# EAGLE design nfc-pn532-old (EAGLE 9.6.2)
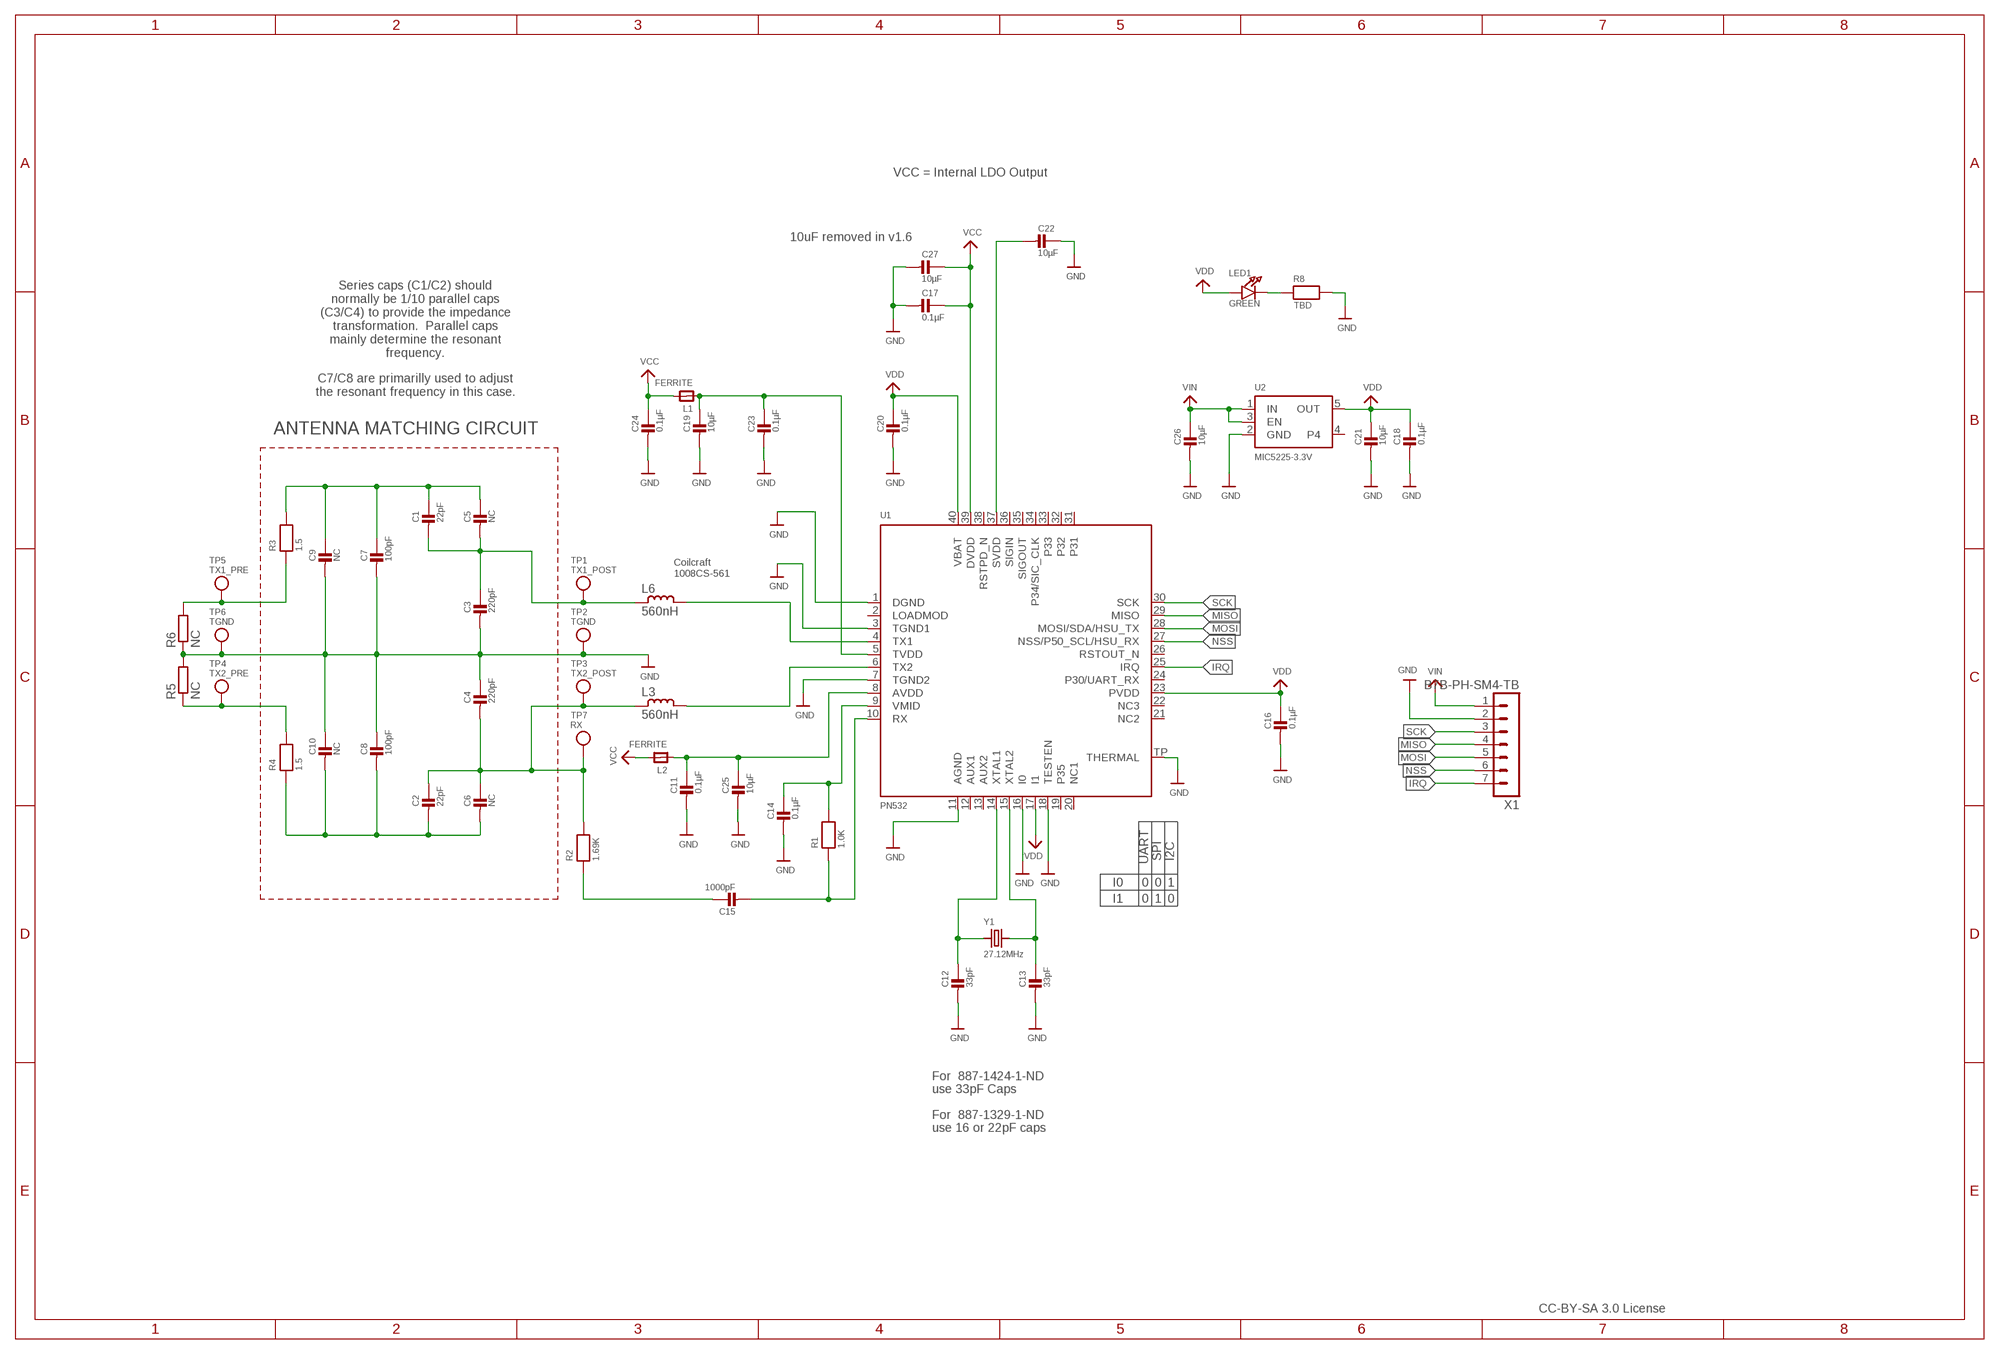
[diagram p0: schematic, sheet 1]

## Parts
C1  22pF  CAP_CERAMIC0805-NOOUTLINE  [0805-NO]
C2  22pF  CAP_CERAMIC0805-NOOUTLINE  [0805-NO]
C3  220pF  CAP_CERAMIC0805-NOOUTLINE  [0805-NO]
C4  220pF  CAP_CERAMIC0805-NOOUTLINE  [0805-NO]
C5  NC  CAP_CERAMIC0805-NOOUTLINE  [0805-NO]
C6  NC  CAP_CERAMIC0805-NOOUTLINE  [0805-NO]
C7  100pF  CAP_CERAMIC0805-NOOUTLINE  [0805-NO]
C8  100pF  CAP_CERAMIC0805-NOOUTLINE  [0805-NO]
C9  NC  CAP_CERAMIC0805-NOOUTLINE  [0805-NO]
C10  NC  CAP_CERAMIC0805-NOOUTLINE  [0805-NO]
C11  0.1µF  CAP_CERAMIC0805-NOOUTLINE  [0805-NO]
C12  33pF  CAP_CERAMIC0805-NOOUTLINE  [0805-NO]
C13  33pF  CAP_CERAMIC0805-NOOUTLINE  [0805-NO]
C14  0.1µF  CAP_CERAMIC0805-NOOUTLINE  [0805-NO]
C15  1000pF  CAP_CERAMIC0805-NOOUTLINE  [0805-NO]
C16  0.1µF  CAP_CERAMIC0805-NOOUTLINE  [0805-NO]
C17  0.1µF  CAP_CERAMIC0805-NOOUTLINE  [0805-NO]
C18  0.1µF  CAP_CERAMIC0805-NOOUTLINE  [0805-NO]
C19  10µF  CAP_CERAMIC0805-NOOUTLINE  [0805-NO]
C20  0.1µF  CAP_CERAMIC0805-NOOUTLINE  [0805-NO]
C21  10µF  CAP_CERAMIC0805-NOOUTLINE  [0805-NO]
C22  10µF  CAP_CERAMIC0805-NOOUTLINE  [0805-NO]
C23  0.1µF  CAP_CERAMIC0805-NOOUTLINE  [0805-NO]
C24  0.1µF  CAP_CERAMIC0805-NOOUTLINE  [0805-NO]
C25  10µF  CAP_CERAMIC0805-NOOUTLINE  [0805-NO]
C26  10µF  CAP_CERAMIC0805-NOOUTLINE  [0805-NO]
C27  10µF  CAP_CERAMIC0805-NOOUTLINE  [0805-NO]
L1  FERRITE  FERRITE0805  [0805]
L2  FERRITE  FERRITE0805  [0805]
L3  560nH  L-1008CS  [L1008CS]
L6  560nH  L-1008CS  [L1008CS]
LED1  GREEN  LED0805_NOOUTLINE  [CHIPLED_0805_NOOUTLINE]
R1  1.0K  RESISTOR0805_NOOUTLINE  [0805-NO]
R2  1.69K  RESISTOR0805_NOOUTLINE  [0805-NO]
R3  1.5  RESISTOR0805_NOOUTLINE  [0805-NO]
R4  1.5  RESISTOR0805_NOOUTLINE  [0805-NO]
R5  NC  R-EU_R0201  [R0201]
R6  NC  R-EU_R0201  [R0201]
R8  TBD  RESISTOR0805_NOOUTLINE  [0805-NO]
TP1  TX1_POST  TESTPOINTROUND1MM  [TESTPOINT_ROUND_1MM]
TP2  TGND  TESTPOINTROUND1MM  [TESTPOINT_ROUND_1MM]
TP3  TX2_POST  TESTPOINTROUND1MM  [TESTPOINT_ROUND_1MM]
TP4  TX2_PRE  TESTPOINTROUND1MM  [TESTPOINT_ROUND_1MM]
TP5  TX1_PRE  TESTPOINTROUND1MM  [TESTPOINT_ROUND_1MM]
TP6  TGND  TESTPOINTROUND1MM  [TESTPOINT_ROUND_1MM]
TP7  RX  TESTPOINTROUND1MM  [TESTPOINT_ROUND_1MM]
U1  PN532  [HVQFN40-6X6]
U2  MIC5225-3.3V  VREG_SOT23-5  [SOT23-5]
X1  B7B-PH-SM4-TB  [B7B-PH-SM4-TB]
Y1  27.12MHz  CRYSTAL3.2X2.5  [CRYSTAL_3.2X2.5]

## Nets
+5.0V: C26.1 U2.1(IN) U2.3(EN) X1.1 ; supply symbol labelled VIN
GND: C3.2 C4.1 C7.2 C8.1 C9.2 C10.1 C11.2 C12.2 C13.2 C14.2 C16.2 C17.2 C18.2 C19.2 C20.2 C21.2 C22.1 C23.2 C24.2 C25.2 C26.2 C27.2 R5.2 R6.1 R8.2 TP2.P$1 TP6.P$1 U1.1(DGND) U1.3(TGND1) U1.7(TGND2) U1.11(AGND) U1.16(I0) U1.18(TESTEN) U1.TP(THERMAL) U2.2(GND) X1.2
IRQ: U1.25(IRQ) X1.7
MISO: U1.29(MISO) X1.4
MOSI: U1.28(MOSI/SDA/HSU_TX) X1.5
N$1: L6.2 U1.4(TX1)
N$2: L3.2 U1.6(TX2)
N$3: C1.2 C3.1 C5.2 L6.1 TP1.P$1
N$4: R3.1 R6.2 TP5.P$1
N$5: R4.2 R5.1 TP4.P$1
N$6: LED1.C R8.1
N$7: C12.1 U1.14(XTAL1) Y1.1
N$8: C13.1 U1.15(XTAL2) Y1.2
N$9: C15.1 R2.1
N$10: C14.1 R1.2 U1.9(VMID)
N$11: C15.2 R1.1 U1.10(RX)
N$12: C2.1 C4.2 C6.1 L3.1 R2.2 TP3.P$1 TP7.P$1
N$13: C11.1 C25.1 L2.1 U1.8(AVDD)
N$14: C19.1 C23.1 L1.1 U1.5(TVDD)
N$15: C22.2 U1.37(SVDD)
NSS: U1.27(NSS/P50_SCL/HSU_RX) X1.6
SCK: U1.30(SCK) X1.3
TX1_ANTENNA: C1.1 C5.1 C7.1 C9.1 R3.2
TX2_ANTENNA: C2.2 C6.2 C8.2 C10.2 R4.1
VCC: C17.1 C24.1 C27.1 L1.2 L2.2 U1.39(DVDD)
VDD: C16.1 C18.1 C20.1 C21.1 LED1.A U1.17(I1) U1.23(PVDD) U1.40(VBAT) U2.5(OUT)
Unconnected: U1.2(LOADMOD) U1.12(AUX1) U1.13(AUX2) U1.19(P35) U1.20(NC1) U1.21(NC2) U1.22(NC3) U1.24(P30/UART_RX) U1.26(RSTOUT_N) U1.31 U1.32 U1.33 U1.34(P34/SIC_CLK) U1.35(SIGOUT) U1.36(SIGIN) U1.38(RSTPD_N) U2.4

## Notes on the sheet
- VCC = Internal LDO Output
- 10uF removed in v1.6
- Series caps (C1/C2) should
  normally be 1/10 parallel caps
  (C3/C4) to provide the impedance
  transformation.  Parallel caps
  mainly determine the resonant
  frequency.
- C7/C8 are primarilly used to adjust
  the resonant frequency in this case.
- ANTENNA MATCHING CIRCUIT
- Coilcraft 
  1008CS-561
- UART | SPI | I2C
- I0 | 0 | 0 | 1
- I1 | 0 | 1 | 0
- For  887-1424-1-ND
- use 33pF Caps
- For  887-1329-1-ND
- use 16 or 22pF caps
- CC-BY-SA 3.0 License

## Library data of the parts
C1-C27 = microbuilder:CAP_CERAMIC: Ceramic Capacitors For new designs, use the packages preceded by an '_' character since they are more reliable: The following footprints should be used on most boards: _0402 - Standard footprint for regular board layouts _0603 - Standard footprint for regular board layouts _0805 - Standard footprint for regular board layouts For extremely tight-pitch boards where space is at a premium, the following 'micro-pitch' footprints can be used (smaller pads, no silkscreen outline, etc.): _0402MP - Micro-pitch footprint for very dense/compact boards _0603MP - Micro-pitch footprint for very dense/compact boards _0805MP - Micro-pitch footprint for very dense/compact boards Commonly Stocked Parts 0402 - 0402 Surface Mount Capacitors 16pF 50V 5% [Digikey: 445-4899-2-ND] 18pF 50V 5% [Digikey: 490-1281-2-ND] 22pF 50V 5% [Digikey: 490-1283-2-ND] 68pF 50V 5% [Digikey: 490-1289-2-ND] 0.1uF 10V 10% [Digikey: 490-1318-2-ND] 1.0uF 6.3V 10% [Digikey: 490-1320-2-ND] 0603 - 0603 Surface Mount Capacitors 16 pF 50V 5% [Digikey: 445-5051-2-ND] 22 pF 50V [Digikey: PCC220ACVTR-ND] 33 pF 50V 5% [Digikey: 490-1415-1-ND] 56pF 50V 5% [Digikey: 490-1421-1-ND] 220pF 50V 5% [Digikey: 445-1285-1-ND] 680 pF 50V 2200 pF 50V 5% C0G [Digikey: 445-1297-1-ND] 5600 pF 100V 5% X7R [Digikey: 478-3711-1-ND] 0.1 µF 25V 10% [Digikey: PCC2277TR-ND] 0.22 µF 16V 10% X7R [Digikey: 445-1318-1-ND] 1.0 µF 25V 10% [Digikey: 445-5146-2-ND] 0603 - RF Specific 3pF 250V +/-0.1pF RF [Digikey: 712-1347-1-ND] 18 pF 250V 5% [Digikey: 478-3505-1-ND or 712-1322-1-ND] 56 pF 250V 5% C0G RF [Digikey: 490-4867-1-ND] 68 pF 250V RF [Digikey: 490-4868-1-ND] 0805 - 0805 Surface Mount Capacitors 220 pF 250V 2% RF Ceramic Capacitor [Digikey: 712-1398-1-ND] 1000 pF 50V 2% NP0 Ceramic Capacitor [Digikey: 478-3760-1-ND] 0.1 µF 25V 10% Ceramic Capacitor [Digikey: PCC1828TR-ND] 1.0 µF 16V 10% Ceramic Capacitor[Digikey: 490-1691-2-ND] 10.0 µF 10V 10% Ceramic Capacitor[Digikey: 709-1228-1-ND] 10.0 uF 16V 10% Ceramic Capacitor [Digikey: 478-5165-2-ND] 47 uF 6.3V 20% Ceramic Capacitor [Digikey: 587-1779-1-ND or 399-5506-1-ND] 1206 - 1206 Surface Mount Capacitors 47uF 10V 20% Ceramic Capacitor [Digikey: 490-5528-1-ND or 399-5508-1-ND or 445-6010-1-ND] 100uF 6.3V -20%, +80% Y5V Ceramic Capacitor (Digikey: 490-4512-1-ND, Mouser: 81-GRM31CF50J107ZE1L)
L1 L2 = microbuilder:FERRITE: Ferrite Bead 0603 MMZ1608B121C - 120 Ohm @ 100MHz, 600mA, 0.15 Ohm DC Resistance - Digikey: 445-2164-1-ND BK1608HW121-T - 120 Ohm, 600mA Ferrite Chip - Digikey: 587-1876-2-ND 0805 HZ0805B272R-10 - 2.7K Ohm @ 100MHz, 200mA, 0.8 Ohm DC Resistance - Digikey: 240-2504-1-ND (see also Murata BLM21BD272SN1L) MMZ2012Y152B - 1.5K Ohm @ 100MHz, 500mA, 0.4 Ohm DC Resistance - Digikey: 445-1560-1-ND - Mainly for high frequency (80-400MHz) MMZ2012R102A - 1K Ohm @ 100MHz, 500mA, 0.3 Ohm DC Resistance - Digikey: 445-1555-2-ND - More general purpose (10-200MHz)
L3 L6 = inductor-coilcraft:L-: SMD INDUCTOR
LED1 = microbuilder:LED: LED 0603 - 0603 Surface Mount Package 2mA: Green LED - Low Power (3.9mcd, 2ma, 1.7Vf) - Digikey: 475-2709-2-ND Orange LED - Low Power (9.8mcd, 2ma, 1.8Vf) - Digikey: 475-1194-2-ND Red LED - Low Power (5mcd, 2ma, 1.8Vf) - Digikey: 475-1195-2-ND Yellow LED - Low Power (7mcd, 2ma, 1.8Vf) - Digikey: 475-1196-2-ND 5mA: Blue LED - Low Power (17mcd, 5ma, 2.9Vf) - Digikey: LNJ937W8CRACT-ND 0805 - 0805 Surface Mount Package 2mA: Red LED (8.8mcd, 2mA, 1.8Vf, Clear) - Low Power [Digikey: 475-2510-1-ND] Green LED (5mcd, 2mA, 1.8Vf, Clear) - Low Power [Digikey: 475-2730-1-ND] Yellow LED (11.3mcd, 2mA, 1.8Vf, Clear) - Low Power [Digikey: 475-2555-1-ND] 20mA: Red LED (104mcd, 20mA, Diffused) - LS R976 [Digikey: 475-1278-6-ND] Red LED (12mcd, 20mA, 2.0Vf, Clear) - APT2012EC [Digikey: 754-1128-1-ND] Green LED (15mcd, 20mA, 2.2Vf, Clear) - APT2012GC [Digikey: 754-1131-1-ND] Orange LED (160mcd, 20mA, 2.1Vf, Clear) - APT2012SECK [Digikey: 754-1130-1-ND] 1206 - 1206 Surface Mount Package Green LED (26mcd, 20mA, Diffused) - LG N971 [Digikey: 475-1407-6-ND] Red LED (15mcd, 20mA, Diffused) - LH N974 [Digikey: 475-1416-6-ND] Cree - Cree High-Power Surface Mount LEDs XPEBWT-L1-0000-00D50 - White 111lm 350mA 2.9Vf 6200K 110° XTEAWT-00-0000-00000LEE3 - White 114lm 350mA 2.85Vf 5000K 115° Everlight - Everlight 45-21 Series Surface Mount LEDs 45-21/QK2C-B2832AC2CB2/2T - Warm White 2000mcd 20mA 3.25Vf 3050K 120° 45-21/LK2C-B38452C4CB2/2T - Nuetral White 2000mcd 20mA 3.25Vf 4150K 120° 45-21/LK2C-B50634C6CB2/2T - Cold White 2200mcd 20mA 3.25Vf 5650K 120° PLCC2 Reverse Mount LS T77K-J1L2-1-0-2-R18-Z - Red 11.25mcd 2mA 1.8Vf 630nm 120° LO T77K-L1M2-24-Z - Orange 19.6mcd 2mA 1.8Vf 606nm 120° LY T77K-K2M1-26-Z - Yellow 15.7mcd 2mA 1.8Vf 587nm 120°
R1-R4 R8 = microbuilder:RESISTOR: Resistors For new designs, use the packages preceded by an '_' character since they are more reliable: The following footprints should be used on most boards: _0402 - Standard footprint for regular board layouts _0603 - Standard footprint for regular board layouts _0805 - Standard footprint for regular board layouts For extremely tight-pitch boards where space is at a premium, the following 'micro-pitch' footprints can be used (smaller pads, no silkscreen outline, etc.): _0402MP - Micro-pitch footprint for very dense/compact boards _0603MP - Micro-pitch footprint for very dense/compact boards _0805MP - Micro-pitch footprint for very dense/compact boards
R5 R6 = rcl:R-EU_: RESISTOR, European symbol
TP1-TP7 = microbuilder:TESTPOINT: Test Point Various test points for characterisation and PCB testing TESTPOINT_SMT - Compact Surface Mount Test Point [Digikey: 5016KTR-ND]
U1 = microbuilder:PN532: PN532 - Near Field Communication (NFC) controller Highly integrated transceiver module for contactless communication at 13.56 MHz (14443A/MIFARE, FeliCa, I4443B)
U2 = microbuilder:VREG_SOT23-5: SOT23-5 Fixed Voltage Regulators Part Current Out V Out V In V Dropout θJA (°C/W) TJ (°C) Digikey Part No. ADP121 150mA 3.3V 3.4-5.5V 0.09V @ 150mA -- -- ADP121-AUJZ33R7CT-ND ADP121 150mA 3.0V 3.1-5.5V 0.09V @ 150mA -- -- ADP121-AUJZ30R7CT-ND ADP122 300mA 3.3V 3.4-5.5V 0.085V @ 300mA -- -- ADP122AUJZ-3.3-R7CT-ND ADP1712 300mA 3.3V 3.5-5.5V 0.17V @ 300mA -- -- ADP1712AUJZ-3.3-R7TR-ND AP7311 (Low Cost) 150mA 3.3V 3.5-6V 0.15V @ 150mA -- -- AP7311-33WG-7DICT-ND LD39015M18R 150mA 1.8V 1.9V-5.5V 0.08V @ 100mA -- -- 497-6977-1-ND LP2985A-33DBVR 150mA 3.3V 3.3-16V 0.28V @ 150mA 206 150 296-18479-1-ND MCP1824T-3302E/OT 300mA 3.3V 3.5V-6V 0.2V @ 300mA -- -- MCP1824T-3302E/OTCT-ND MIC5205-2.5YM5 TR 150mA 2.5V 2.7-16V 0.165V @ 150mA -- -- 576-1257-2-ND MIC5205-3.0YM5 TR 150mA 3.0V 3.2V-16V 0.165V @ 150mA -- -- 576-1258-2-ND MIC5205-3.3YM5 TR 150mA 3.3V 3.5V-16V 0.165V @ 150mA -- -- 576-1259-2-ND TPS780330220 150mA 3.3V+2.2V 3.6-5.5V 250mV Max -- -- 296-23332-1-ND TDA3663/N1,135 100mA 3.3V 3.5-45V 0.18V @ 50mA -- -- 568-5343-1-ND Max operating temp can be calculated using θJA, TJ (max junction temperature), and power in watts. Set the "Maximum Ambient Temperature" until it reaches TJ ("Max Junction Temperature"), which is the absolute limit for safe use of the regulator: Heat Sink Temperature Calculator <http://www.daycounter.com/Calculators/Heat-Sink-Temperature-Calculator.phtml> For example, With 12V source into a 3.3V LP2985 and a 30mA load, we are dissipating (12V-3.3V) * 0.03A = 0.261W. With a θJA of 206 °C/W, a TJ of 150°C, and 261mW we can safely use the chip without a heat sink up to 75°C (=147.1°C Junction Temperature).
X1 = con-JST PH:B7B-PH: JST PH series header 2.00mm pitch disconnectable crimp style connectors, vertical (side entry type), 7 pins
Y1 = microbuilder:CRYSTAL: Crystals HC49UP - Surface Mount Crystal 4.0MHz 18pF +/-30ppm Surface Mount Crystal [Digikey: 535-9857-1-ND] 12.0 MHz Surface Mount Crystal [Digikey: 535-9869-6-ND] 25.0 MHz Surface Mount Crystal [Digikey: 535-9078-1-ND] 2.5 x 2.0mm - MEMs SMT Crystal 16.0 MHz 10pF 20ppm 2.5 x 2.0mm Crystal [Digikey -40-85°C: 535-10923-1-ND] 3.2 x 2.5mm - MEMs SMT Crystal 12.0 MHz 8pF 15ppm 3.2 x 2.5mm Crystal [Digikey: -10-70°C: 644-1047-1-ND -40-125°C: 644-1128-1-ND] 40~85°C cheaper: 644-1173-6-ND 16.0 MHz 8pF 15ppm 3.2 x 2.5mm Crystal [Digikey: -10-70°C: 644-1049-1-ND -40-125°C: 644-1129-2-ND]-40~85°C cheaper: 644-1175-6-ND 16.0 MHz 10pF 10ppm 3.2 x 2.5mm Crystal [Digikey: 644-1100-1-ND] 27.12 MHz 18pF 30ppm 3.2 x 2.5mm Crystal [Digikey: 887-1424-1-ND] 27.12MHz 10pF 10ppm 3.2 x 2.5mm Crystal [Digikey: 887-1329-1-ND] 4.9 x 1.8mm - MEMs SMT Crystal 32.768 KHz 12.5pF 20ppm 4.9 x 1.8mm Crystal [Digikey: SE2415CT-ND] 8.0 x 3.8mm - Surface Mount Crystal 32.768kHz 12.5pF 20ppm -40°C-85°C [Digikey: 535-9166-2-ND] Cylinder 32.768KHz Cylinder Crystal (2x6mm body) [Ex. Digikey: 300-8341-2-ND]

## Board
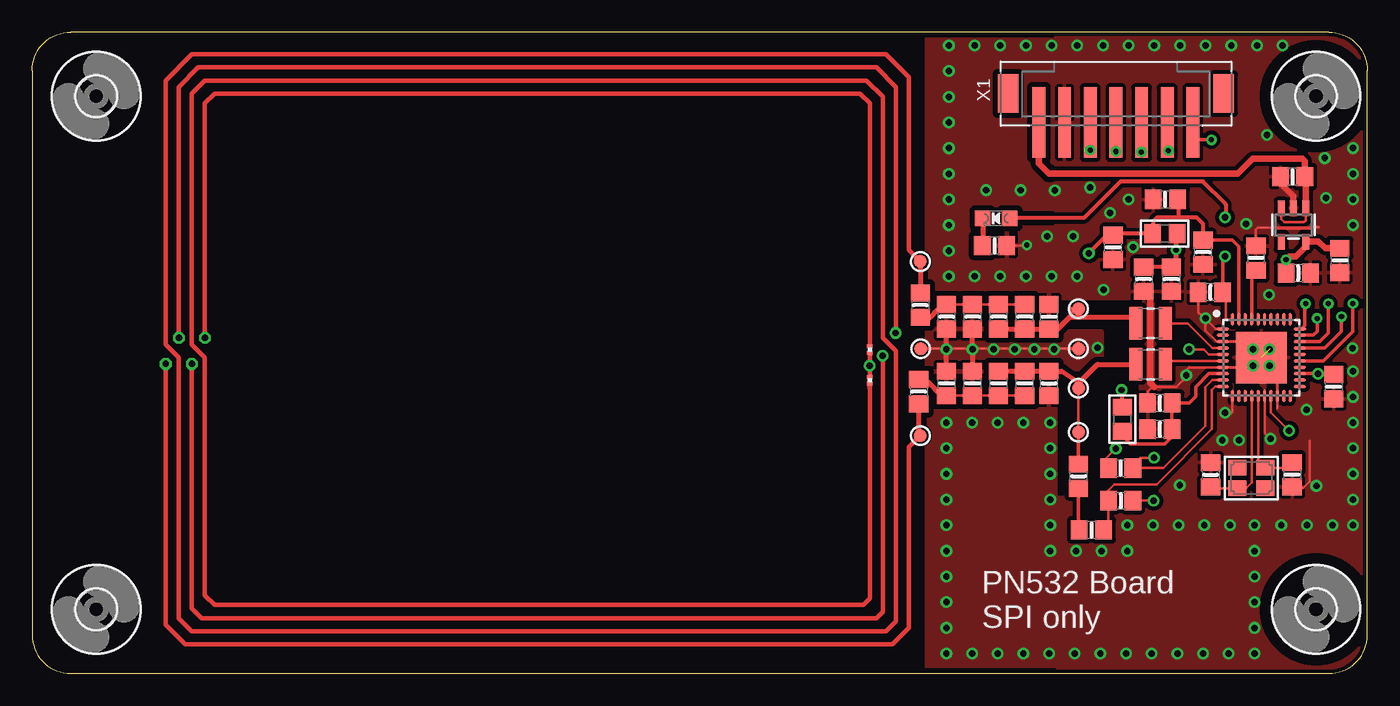
[diagram p1: board, top side]
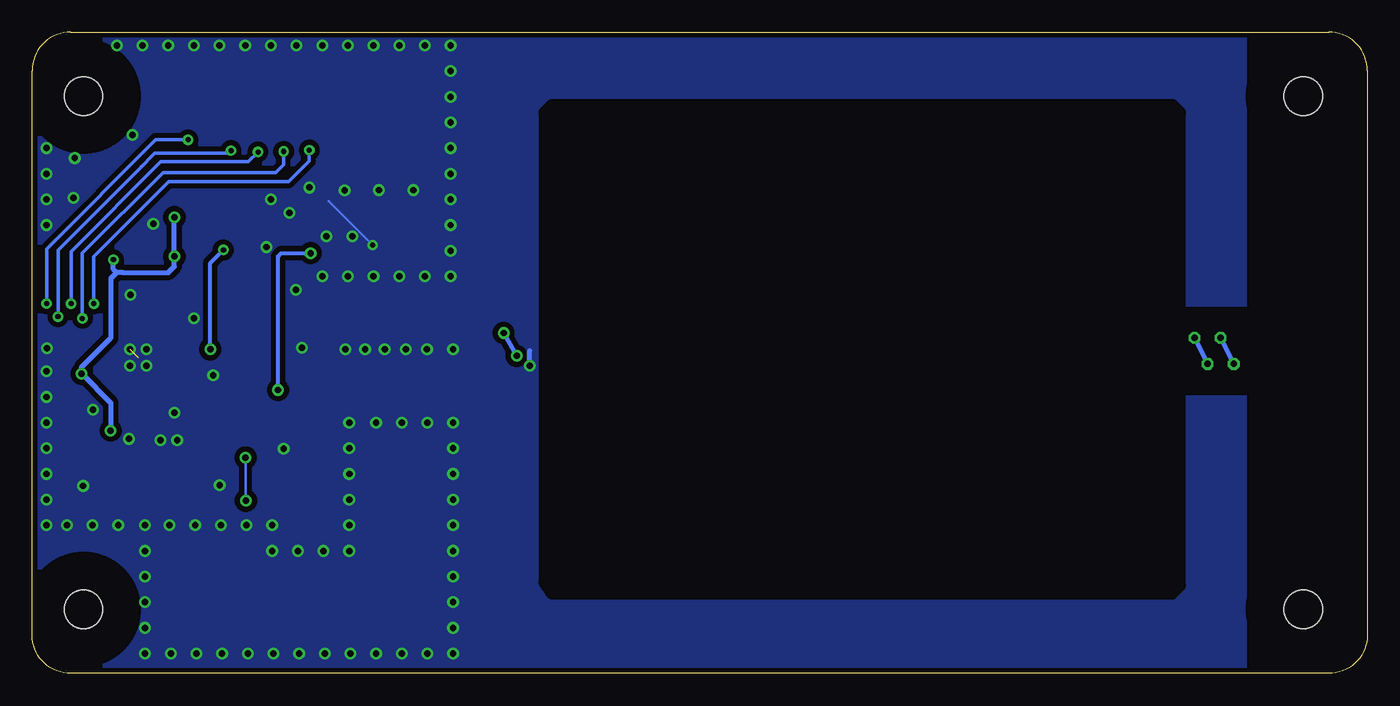
[diagram p2: board, bottom side, seen from below]

Size 104.06 x 50 mm. Coordinates in mm from the lower left corner, seen from the top.
Outline: 101.06,50 3,50 arc90 0,47 0,3 arc90 3,0 101.06,0 arc90 104.06,3 104.06,47 arc90 101.06,50
Copper layers (1*16): Top 0.035mm / dielectric 1.5mm / Bottom 0.035mm
Design rules "adafruit *": minimum track width 8mil, minimum drill 15.5mil, track to track 8mil, track to pad 8mil, pad to pad 8mil, via to via 8mil, smd to smd 0mil, copper to edge 10mil, drill to drill 8mil, minimum pad ring 10mil, minimum via ring 8mil, stop-mask expansion 2mil, vias tented up to drill 20mil, thermal gap 10mil
bRestrict: area 9.1,26.9 to 14.2,28.2; area 9.1,22.1 to 14.2,23.4; area 14.7,6.3 to 64,44.2

### Footprints (pad centres in the part's own frame; a part is rotated, then mirrored left to right if it is on the bottom)
0805-NO = smd 1.3 x 1.5: 1 -0.95,0; 2 0.95,0
0805 = smd 1.3 x 1.5: 1 -0.95,0; 2 0.95,0
L1008CS = smd 1.02 x 2.54: 1 -1.145,0; 2 1.145,0
CHIPLED_0805_NOOUTLINE = smd 1.2 x 1.2: A 0,-1.05; C 0,1.05
R0201 = smd 0.28 x 0.43: 1 -0.255,0; 2 0.255,0
TESTPOINT_ROUND_1MM = smd 1 x 1: P$1 0,0
HVQFN40-6X6 = smd 1 x 0.25: 1 -2.99,2.25; 2 -2.99,1.75; 3 -2.99,1.25; 4 -2.99,0.75; 5 -2.99,0.25; 6 -2.99,-0.25; 7 -2.99,-0.75; 8 -2.99,-1.25; 9 -2.99,-1.75; 10 -2.99,-2.25; 21 2.99,-2.25; 22 2.99,-1.75; 23 2.99,-1.25; 24 2.99,-0.75; 25 2.99,-0.25; 26 2.99,0.25; 27 2.99,0.75; 28 2.99,1.25; 29 2.99,1.75; 30 2.99,2.25 | smd 0.25 x 1: 11 -2.25,-2.99; 12 -1.75,-2.99; 13 -1.25,-2.99; 14 -0.75,-2.99; 15 -0.25,-2.99; 16 0.25,-2.99; 17 0.75,-2.99; 18 1.25,-2.99; 19 1.75,-2.99; 20 2.25,-2.99; 31 2.25,2.99; 32 1.75,2.99; 33 1.25,2.99; 34 0.75,2.99; 35 0.25,2.99; 36 -0.25,2.99; 37 -0.75,2.99; 38 -1.25,2.99; 39 -1.75,2.99; 40 -2.25,2.99 | smd 4 x 4: TP 0,0
SOT23-5 = smd 0.55 x 1.2: 1 -0.95,-1.3; 2 0,-1.3; 3 0.95,-1.3; 4 0.95,1.3; 5 -0.95,1.3
MOUNTINGHOLE_3.0 = hole 3: 0,0
B7B-PH-SM4-TB = smd 1 x 5.5: 1 6,0; 2 4,0; 3 2,0; 4 0,0; 5 -2,0; 6 -4,0; 7 -6,0 | smd 1.6 x 3: M1 8.4,-2.25; M2 -8.4,-2.25
CRYSTAL_3.2X2.5 = smd 1.4 x 1.2: 1 -1.1,-0.8; 2 1.1,0.8; GND1 -1.1,0.8; GND2 1.1,-0.8

### Placement (x,y rotation side)
C1  75.31,27.81 270 top
C2  75.31,22.61 270 top
C3  79.24,27.81 90 top
C4  79.24,22.61 90 top
C5  77.33,27.81 270 top
C6  77.33,22.61 270 top
C7  73.28,27.81 270 top
C8  73.28,22.61 270 top
C9  71.25,27.81 270 top
C10  71.25,22.61 270 top
C11  87.88,19.05 180 top
C12  91.84,15.49 90 top
C13  98.19,15.49 270 top
C14  84.83,16.01 180 top
C15  82.55,11.19 0 top
C16  101.43,22.35 270 top
C17  91.24,32.84 270 top
C18  101.91,32.2 270 top
C19  86.62,30.73 270 top
C20  91.82,29.72 180 top
C21  98.67,31.21 0 top
C22  95.38,32.38 270 top
C23  88.78,30.73 270 top
C24  84.23,33.22 270 top
C25  87.88,21.08 180 top
C26  98.23,38.73 180 top
C27  88.31,36.95 180 top
L1  88.27,34.29 180 top
L2  84.96,19.81 90 top
L3  87.16,24.1 0 top
L6  87.16,27.3 0 top
LED1  75.13,35.48 90 top
R1  84.83,13.47 0 top
R2  81.53,15.37 90 top
R3  69.22,28.71 270 top
R4  69.1,21.97 270 top
R5  65.28,25.24 90 top
R6  65.28,22.86 270 top
R8  75,33.35 0 top
TP1  81.53,28.43 0 top
TP2  81.53,25.33 0 top
TP3  81.53,22.22 0 top
TP4  69.22,18.54 0 top
TP5  69.22,32.11 0 top
TP6  69.23,25.33 0 top
TP7  81.53,18.8 0 top
U1  95.79,24.62 0 top
U2  98.3,34.96 180 top
U$6  [MOUNTINGHOLE_3.0]  5,45 0 top
U$36  [MOUNTINGHOLE_3.0]  5,5 0 top
U$37  [MOUNTINGHOLE_3.0]  100.06,5 0 top
U$38  [MOUNTINGHOLE_3.0]  100.06,45 0 top
X1  84.46,42.95 180 top
Y1  95.01,15.24 0 top

### Tracks (layer width: path | path; a pad name or v marks a point on that pad's centre or on a via)
+5.0V
  Top 0.203: U2.3 97.35,35.42 97.59,35.18 99.12,35.18 99.25,35.31 U2.1
  Top 0.508: U2.1 99.25,38.66 C26.1 99.18,39.95 98.99,40.13 95.14,40.13 93.97,38.96 79.25,38.96 78.46,39.75 X1.1
GND  (via drill 0.39, 0.5)  (1 unrouted)
  Top 0.203: 97.04,20.67 U1.18 97.04,23.37 U1.TP | U1.1 92.26,26.87 v91.44,27.69 | 99.57,18.14 99.57,14.99 99.06,14.48 98.53,14.48 C13.2 | TP6.P$1 73.28,25.33 TP2.P$1 | U1.11 93.54,20.4 93.46,20.32 v92.96,20.32 | 94.74,23.88 94.74,23.87 U1.7 90.18,23.87 90.17,23.88 89.66,23.37 89.66,22.86 89.15,22.35 87.46,22.35 87.3,22.35 86.93,21.98 C25.2 | 93.98,26.42 94.23,26.42 94.23,25.91 arc-90 94.2,25.87 U1.3 92.32,25.87 91.44,26.75 v91.44,27.69 | v84.45,17.53 83.44,16.55 C14.2 | C20.2 90.87,28.13 v91.44,27.69 | U1.16 96.04,18.77 v96.52,18.29 | C22.1 95.38,34.62 95.51,34.75 97.1,34.75 97.12,34.72 | 99.58,34.72 99.66,34.8 100.26,34.8 | v77.53,33.4 77.47,33.35 R8.2
  Top 0.254: 97.12,34.72 99.58,34.72
  Top 0.356: R5.2 v65.28,24 R6.1
  Top 0.406: C8.1 73.28,25.33 C7.2 | C10.1 C9.2 | 65.28,22.23 R6.1
  Top 0.508: U2.2 98.3,37.21 97.28,38.23 C26.2 | 87.16,22.65 87.46,22.35 | 87.16,23.4 87.16,22.65 | C19.2 87.16,29.25 87.16,22.65
  Bottom 0.203: 80.95,36.83 v77.53,33.4
  Bottom 0.406: v65.28,24 65.28,25.15
  other vias: 71.25,25.27 73.28,25.27 74.93,25.27 76.58,25.27 100.08,14.62 89.95,23.24 85.8,33.24 84,35.91 92.75,18.19 99.32,20.55 89.44,14.68 79.63,25.27 78.11,25.27 94.61,35.05 71.25,3.56 71.25,5.56 71.25,7.56 71.25,9.56 71.25,11.56 71.25,13.56 71.25,15.56 71.25,17.56 71.25,19.56 73.25,19.56 75.25,19.56 77.25,19.56 79.35,19.56 71.45,30.96 71.45,32.96 71.45,34.96 71.45,36.96 71.45,38.96 71.45,40.96 71.45,42.96 71.45,44.96 71.45,46.96 71.45,48.96 73.45,30.96 75.45,30.96 77.45,30.96 79.45,30.96 81.45,30.96 83.5,29.91 79.35,17.56 79.35,15.56 79.35,13.56 79.35,11.56 79.35,9.56 81.35,9.56 83.35,9.56 85.35,9.56 85.35,11.56 87.35,11.56 89.35,11.56 91.35,11.56 93.35,11.56 97.35,11.56 99.35,11.56 101.35,11.56 102.95,11.56 102.95,13.56 102.95,15.56 102.95,17.56 102.95,19.56 102.95,21.56 102.95,23.56 102.9,25.36 102.95,34.96 102.95,36.96 71.25,1.56 73.25,1.56 75.25,1.56 77.25,1.56 79.25,1.56 81.25,1.56 83.25,1.56 85.25,1.56 87.25,1.56 89.25,1.56 91.25,1.56 93.25,1.56 95.25,1.56 95.25,3.56 95.25,5.56 95.25,7.56 95.25,9.56 95.25,11.56 73.45,48.96 75.45,48.96 77.45,48.96 79.45,48.96 81.45,48.96 83.45,48.96 85.45,48.96 87.45,48.96 89.45,48.96 91.45,48.96 93.45,48.96 95.45,48.96 97.45,48.96 102.95,38.96 102.95,40.96 96.23,41.98 100.73,40.18 82.44,37.88 81.13,34.08 96.38,29.53 100.83,37.08 74.33,37.68 77.03,37.68 83.03,25.38 95.13,23.98 95.13,25.28 96.44,23.98 96.44,25.28 94.05,18.19 79.7,37.66 79.08,34.08 85.45,36.96
  pour Top (isolate 0.305): 79.76,51.36 105.21,51.36 105.21,-1.01 79.91,-1.01 79.91,13.72 86.36,13.72 86.36,29.21 79.76,29.21
  pour Top (isolate 0.406): 69.72,51.36 79.76,51.36 79.76,-1.06 69.72,-1.06
  pour Top (isolate 0.406): 80.01,26.67 83.31,26.67 83.31,23.62 80.01,23.62
  pour Bottom (isolate 0.406): 9.61,-1.02 105.14,-1.02 105.14,51.37 9.61,51.37
IRQ  (via drill 0.39)
  Top 0.254: U1.25 100.62,24.37 102.93,26.67 v102.93,28.83 | v91.91,41.6 90.71,41.6 90.46,41.85 X1.7
  Bottom 0.254: v102.93,28.83 102.93,33.08 94.41,41.6 v91.91,41.6
MISO  (via drill 0.39)
  Top 0.254: U1.29 99.83,26.37 100.13,26.67 v100.13,27.69 | X1.4 v84.46,40.7
  Bottom 0.254: v100.13,27.69 100.13,32.77 93.86,39.04 85.06,39.04 84.46,39.65 v84.46,40.7
MOSI  (via drill 0.39)
  Top 0.254: U1.28 100.35,25.87 101.02,26.54 v101.02,28.83 | v86.46,40.65 X1.5
  Bottom 0.254: v101.02,28.83 101.02,32.89 94.03,39.88 87.22,39.88 v86.46,40.65
N$1
  Top 0.203: U1.4 91.98,25.37 90.05,27.3 L6.2
N$2
  Top 0.203: L3.2 88.57,24.37 U1.6
N$3
  Top 0.203: C1.2 C5.2
  Top 0.406: TP1.P$1 80.98,28.39 80.98,27.9 80.86,27.77 | C1.2 C3.1 78.83,26.8 79.88,26.8 80.86,27.77 | L6.1 86.06,27.34 86.06,27.8 86.03,27.77 80.86,27.77
N$4
  Top 0.356: TP5.P$1 68.33,33 68.33,46.47 66.55,48.26 12.45,48.26 10.41,46.23 10.41,25.65 11.43,24.64 11.43,4.32 12.45,3.3 66.55,3.3 67.31,4.06 67.31,25.15 66.29,26.16 66.29,44.96 65.02,46.23 13.46,46.23 12.45,45.21 12.45,25.65 13.46,24.64 13.46,6.1 14.22,5.33 64.77,5.33 65.28,5.84 R6.2
  Top 0.406: TP5.P$1 R3.1
N$5  (via drill 0.5)
  Top 0.356: v10.41,24.13 10.41,3.81 11.94,2.29 67.06,2.29 68.33,3.56 68.33,17.65 TP4.P$1 | v11.43,26.16 11.43,45.72 12.95,47.24 65.79,47.24 67.31,45.72 v67.31,26.54 | v66.29,24.77 66.29,4.83 65.79,4.32 13.21,4.32 12.45,5.08 v12.45,24.13 | v13.46,26.16 13.46,44.45 14.22,45.21 64.52,45.21 65.28,44.45 R5.1 65.28,24.86
  Top 0.406: R4.2 69.1,18.67 TP4.P$1
  Bottom 0.406: v11.43,26.16 v10.41,24.13 | v67.31,26.54 v66.29,24.77 | v12.45,24.13 v13.46,26.16
N$6
  Top 0.406: LED1.C 74.08,33.38 R8.1
N$7
  Top 0.203: C12.1 91.63,14.44 Y1.1 93.95,14.48 94.63,14.48 95.04,14.89 U1.14
N$8
  Top 0.203: C13.1 98.39,16.04 Y1.2 95.54,16.61 U1.15
N$9
  Top 0.254: R2.1 81.53,12.26 C15.1
N$10  (via drill 0.5)
  Top 0.203: U1.9 91.96,22.87 91.44,22.35 91.44,19.3 88.14,16.01 C14.1 | C14.1 85.85,16.26 | R1.2 v87.39,13.47 | v87.42,16.82 86.35,16.82 C14.1
  Bottom 0.203: v87.42,16.82 87.42,13.5 v87.39,13.47
N$11
  Top 0.203: U1.10 92.22,22.37 91.95,22.1 91.95,19.05 87.64,14.74 84.34,14.74 83.82,14.22 R1.1 83.88,11.57 C15.2
N$12
  Top 0.203: TP7.P$1 TP3.P$1
  Top 0.254: R2.2 TP7.P$1
  Top 0.406: C2.1 C6.1 C4.2 80.23,23.56 81.53,22.69 TP3.P$1 81.53,22.61 83.03,24.1 L3.1
N$13
  Top 0.203: L2.1 84.96,18.54
  Top 0.254: U1.8 91.7,23.37 90.68,22.35 90.68,21.59 90.17,21.08 C25.1 C11.1 88.73,18.38 88.27,17.91 85.59,17.91 84.96,18.54
N$14  (via drill 0.41, 0.5)
  Top 0.203: U1.5 91.72,24.87 91.31,25.27 v90.17,25.27
  Top 0.305: 88.77,31.71 C23.1 | 88.75,31.68 C19.1 | v89.15,33.02 89.13,33.01
  Top 0.406: 88.75,31.68 88.77,31.71 89.11,32.08 89.11,32.77 89.13,33.01 L1.1
  Bottom 0.305: v90.17,25.27 90.17,32 v89.16,33.02 v89.15,33.02
N$15
  Top 0.254: C22.2 95.38,31.32 95.04,30.98 U1.37
NSS  (via drill 0.39)
  Top 0.254: U1.27 100.74,25.37 102.04,26.67 v102.04,27.81 | v88.56,40.75 88.46,40.85 X1.6
  Bottom 0.254: 95.69,39.37 102.04,33.02 v102.04,27.81 | 95.69,39.37 95.56,39.5 | 95.69,39.37 94.49,40.57 88.73,40.57 v88.56,40.75
SCK  (via drill 0.39)
  Top 0.203: U1.30 99.21,26.87
  Top 0.254: v99.24,28.83 99.16,28.83 99.16,27.12 98.91,26.87 U1.30 | v82.46,40.8 X1.3
  Bottom 0.254: v99.24,28.83 99.24,32.51 93.4,38.35 84.05,38.35 82.46,39.95 v82.46,40.8
TX1_ANTENNA
  Top 0.203: C9.1 C7.1 C1.1 C5.1
  Top 0.406: C9.1 71.2,28.36 70.61,28.36 70,27.75 R3.2
TX2_ANTENNA
  Top 0.203: C10.2 C8.2 C2.2 C6.2
  Top 0.406: C10.2 70.84,21.66 69.75,22.75 69.26,22.75 R4.1
VCC  (via drill 0.5)
  Top 0.254: U1.39 94.04,33.27 93.53,33.78 91.75,33.78 C17.1
  Top 0.305: L2.2 84.96,22.03 v84.89,22.1 | v82.35,32.77 83.76,34.17 C24.1 84.35,34.29 L1.2 87.41,35.29 87.69,35.56 89.31,35.56 | 89.31,35.56 90.73,35.56 91.24,35.05 C17.1 | C27.1 89.31,36.9 89.31,35.56
  Bottom 0.305: v84.89,22.1 84.89,31.24 84.89,32.51 84.64,32.77 v82.35,32.77
VDD  (via drill 0.39, 0.5)
  Top 0.203: v100.2,23.37 | U1.40 93.1,27.61 93.02,27.69 93.02,29.2 C20.1 | U1.17 96.54,20.34 v97.94,18.94
  Top 0.254: v100.2,23.37 U1.23 | C20.1 92.77,32.32 v92.96,32.51 | v100.2,23.37 100.27,23.3 C16.1
  Top 0.305: LED1.A 76.2,35.5 81.95,35.5 84.8,38.35 91.25,38.35 93.02,36.58 93.02,35.62 v92.96,35.56
  Top 0.406: 99.3,33.61 U2.5
  Top 0.508: C21.1 v97.72,32.26 97.97,32.51 98.48,32.51 99.25,33.28 U2.5 100.25,33.66 100.76,33.15 C18.1
  Bottom 0.254: 92.96,31.71 v92.96,32.51
  Bottom 0.406: 97.46,31.24 97.92,30.79 97.92,26.16 100.2,23.88 v100.2,23.37 97.92,21.08 97.92,18.92 97.93,18.92 v97.94,18.94 | 97.46,31.24 96.96,31.24 93.43,31.24 92.96,31.71 v92.96,32.51 v92.96,35.56 | 97.46,31.24 97.72,31.5 v97.72,32.26

### Text on the board
tNames: PN532 Board / SPI only